# Altium schematic sheet ArduinoDue.SchDoc
size A4
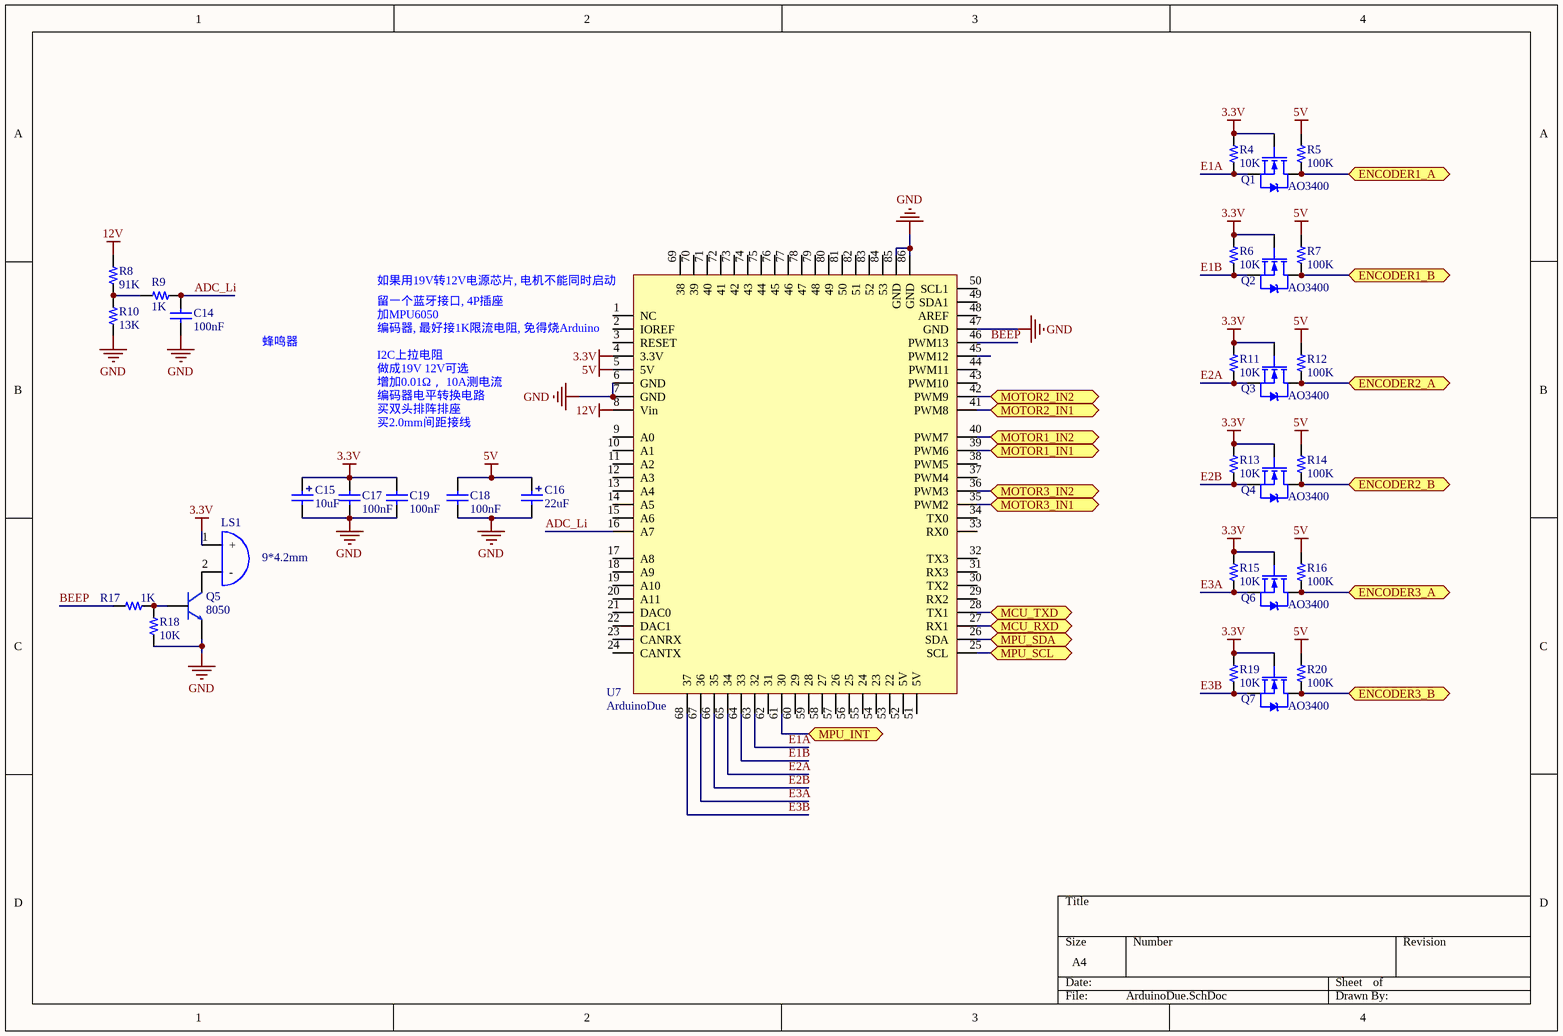
[diagram p0: ArduinoDue.SchDoc]

## Parts
C14  value 100nF  [dq - 0402]  (hidden comment: Cap)
C15  value 10uF  [3216-18]  (hidden comment: Cap_Pol)
C16  value 22uF  [3528-21]  (hidden comment: Cap_Pol)
C17  value 100nF  [dq - 0402]  (hidden comment: Cap)
C18  value 100nF  [dq - 0402]  (hidden comment: Cap)
C19  value 100nF  [dq - 0402]  (hidden comment: Cap)
LS1  9*4.2mm  [BUZZER-9*4.2MM]
Q1  AO3400  [SOT-23-3 - AO3400]
Q2  AO3400  [SOT-23-3 - AO3400]
Q3  AO3400  [SOT-23-3 - AO3400]
Q4  AO3400  [SOT-23-3 - AO3400]
Q5  8050  [SOT-23-3]
Q6  AO3400  [SOT-23-3 - AO3400]
Q7  AO3400  [SOT-23-3 - AO3400]
R4  value 10K  [dq - 0402]  (hidden comment: Res)
R5  value 100K  [dq - 0402]  (hidden comment: Res)
R6  value 10K  [dq - 0402]  (hidden comment: Res)
R7  value 100K  [dq - 0402]  (hidden comment: Res)
R8  value 91K  [dq - 0402]  (hidden comment: Res)
R9  value 1K  [dq - 0402]  (hidden comment: Res)
R10  value 13K  [dq - 0402]  (hidden comment: Res)
R11  value 10K  [dq - 0402]  (hidden comment: Res)
R12  value 100K  [dq - 0402]  (hidden comment: Res)
R13  value 10K  [dq - 0402]  (hidden comment: Res)
R14  value 100K  [dq - 0402]  (hidden comment: Res)
R15  value 10K  [dq - 0402]  (hidden comment: Res)
R16  value 100K  [dq - 0402]  (hidden comment: Res)
R17  value 1K  [dq - 0402]  (hidden comment: Res)
R18  value 10K  [dq - 0402]  (hidden comment: Res)
R19  value 10K  [dq - 0402]  (hidden comment: Res)
R20  value 100K  [dq - 0402]  (hidden comment: Res)
U7  ArduinoDue  [ArduinoDue]

## Ports
ENCODER1_A, ENCODER1_B, ENCODER2_A, ENCODER2_B, ENCODER3_A, ENCODER3_B, MCU_RXD, MCU_TXD, MOTOR1_IN1, MOTOR1_IN2, MOTOR2_IN1, MOTOR2_IN2, MOTOR3_IN1, MOTOR3_IN2, MPU_INT, MPU_SCL, MPU_SDA

## Nets
3.3V: C15.1 C17.2 C19.2 LS1.1(+) Q1.1(G) Q2.1(G) Q3.1(G) Q4.1(G) Q6.1(G) Q7.1(G) R4.1 R6.1 R11.1 R13.1 R15.1 R19.1 U7.4(3.3V)
5V: C16.1 C18.2 R5.1 R7.1 R12.1 R14.1 R16.1 R20.1 U7.5(5V)
12V: R8.1 U7.8(Vin)
GND: C14.1 C15.2 C16.2 C17.1 C18.1 C19.1 Q5.1(e) R10.2 R18.2 U7.6(GND) U7.7(GND) U7.47(GND) U7.85(GND) U7.86(GND)
ADC_Li: C14.2 R9.2 U7.16(A7)
BEEP: R17.2 U7.46(PWM13)
E1A: Q1.3(S) R4.2 U7.63(32)
E1B: Q2.3(S) R6.2 U7.64(33)
E2A: Q3.3(S) R11.2 U7.65(34)
E2B: Q4.3(S) R13.2 U7.66(35)
E3A: Q6.3(S) R15.2 U7.67(36)
E3B: Q7.3(S) R19.2 U7.68(37)
ENCODER1_A: Q1.2(D) R5.2 ; port ENCODER1_A
ENCODER1_B: Q2.2(D) R7.2 ; port ENCODER1_B
ENCODER2_A: Q3.2(D) R12.2 ; port ENCODER2_A
ENCODER2_B: Q4.2(D) R14.2 ; port ENCODER2_B
ENCODER3_A: Q6.2(D) R16.2 ; port ENCODER3_A
ENCODER3_B: Q7.2(D) R20.2 ; port ENCODER3_B
MCU_RXD: U7.27(RX1) ; port MCU_RXD
MCU_TXD: U7.28(TX1) ; port MCU_TXD
MOTOR1_IN1: U7.39(PWM6) ; port MOTOR1_IN1
MOTOR1_IN2: U7.40(PWM7) ; port MOTOR1_IN2
MOTOR2_IN1: U7.41(PWM8) ; port MOTOR2_IN1
MOTOR2_IN2: U7.42(PWM9) ; port MOTOR2_IN2
MOTOR3_IN1: U7.35(PWM2) ; port MOTOR3_IN1
MOTOR3_IN2: U7.36(PWM3) ; port MOTOR3_IN2
MPU_INT: U7.61(30) ; port MPU_INT
MPU_SCL: U7.25(SCL) ; port MPU_SCL
MPU_SDA: U7.26(SDA) ; port MPU_SDA
NetLS1_2: LS1.2(-) Q5.3(c)
NetQ5_2: Q5.2(b) R17.1 R18.1
NetR8_2: R8.2 R9.1 R10.1

Not connected (* = marked no-connect by the designer): U7 1(NC) 2(IOREF) 3(RESET) 9(A0) 10(A1) 11(A2) 12(A3) 13(A4) 14(A5) 15(A6) 17(A8) 18(A9) 19(A10) 20(A11) 21(DAC0) 22(DAC1) 23(CANRX) 24(CANTX) 29(RX2) 30(TX2) 31(RX3) 32(TX3) 33(RX0) 34(TX0) 37(PWM4) 38(PWM5) 43(PWM10) 44(PWM11) 45(PWM12) 48(AREF) 49(SDA1) 50(SCL1) 51(5V) 52(5V) 53(22) 54(23) 55(24) 56(25) 57(26) 58(27) 59(28) 60(29) 62(31) 69(38) 70(39) 71(40) 72(41) 73(42) 74(43) 75(44) 76(45) 77(46) 78(47) 79(48) 80(49) 81(50) 82(51) 83(52) 84(53)

## Notes on the sheet
- 留一个蓝牙接口, 4P插座
- 如果用19V转12V电源芯片, 电机不能同时启动
- 蜂鸣器
- 加MPU6050
- 编码器, 最好接1K限流电阻, 免得烧Arduino
- I2C上拉电阻
- 做成19V 12V可选
- 增加0.01Ω， 10A测电流
- 编码器电平转换电路
- 买双头排阵排座
- 买2.0mm间距接线

## Library data of the parts
C14 C17-C19 = DQ_Cap: Capacitor; Published: 8-Jun-2000; LatestRevisionDate: 17-Jul-2002; LatestRevisionNote: Re-released for DXP Platform.; PackageReference: RAD-0.3; Publisher: Altium Limited
C15 C16 = Cap_Pol: Capacitor; Published: 8-Jun-2000; LatestRevisionDate: 17-Jul-2002; LatestRevisionNote: Re-released for DXP Platform.; PackageReference: RAD-0.3; Publisher: Altium Limited
LS1 = Buzzer_1: Electrical Bell; Published: 24-Mar-1999; LatestRevisionDate: 17-Jul-2002; LatestRevisionNote: Re-released for DXP Platform.; PackageReference: PIN2; Publisher: Altium Limited
Q1-Q4 Q6 Q7 = NMOS: N-Channel Power MOSFET; Note: Pin 2 is electrically connected to pin 4.; Published: 8-Jun-2000; LatestRevisionDate: 17-Jul-2002; LatestRevisionNote: Re-released for DXP Platform.; DatasheetDocument: PD-9.814; PackageReference: TO-220AB; Publisher: Altium Limited; Code_JEDEC: TO-220-AB; ComponentLink1Description: Manufacturer Link; ComponentLink1URL: http://www.irf.com/
Q5 = NPN
R4-R20 = DQ_Res: Resistance